# Altium schematic sheet 5_Motor_Controller.SchDoc
size A
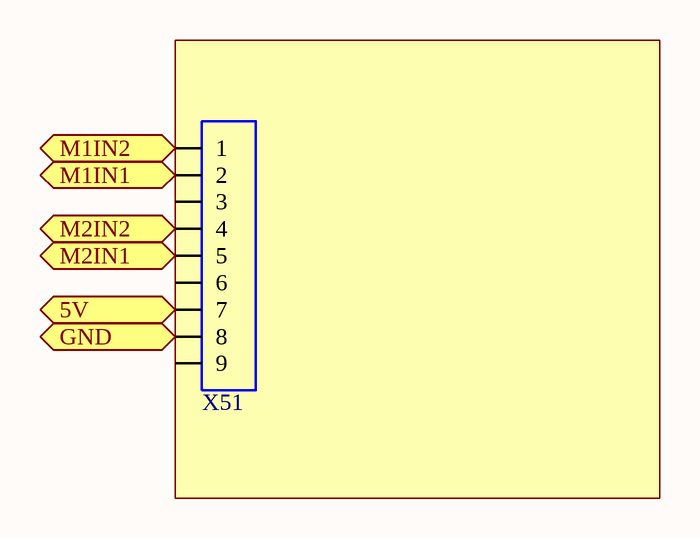
[diagram p0: 5_Motor_Controller.SchDoc]

## Parts
X51  TE 87220-9  [HDR-0.1-9]  (value not drawn)

## Ports
5V, GND, M1IN1, M1IN2, M2IN1, M2IN2

## Nets
5V: X51.7 ; port 5V
GND: X51.8 ; port GND
M1IN1: X51.2 ; port M1IN1
M1IN2: X51.1 ; port M1IN2
M2IN1: X51.5 ; port M2IN1
M2IN2: X51.4 ; port M2IN2

Not connected (* = marked no-connect by the designer): X51 3 6 9

## Library data of the parts
X51 = 7236: Connector 9 pin general; Part Field 1: CONN9 9X1 2.54mm VERT PIN HEADER; Manufacturer: TE Connectivity; IPN: 7236; EndOfLife: Active EOL:Jul 2022; Characteristics: 0.78um GOLD; Lead_Process_Compatible: Yes; SubmittedBy: ZAD; DeviceRank: 2; Part Field 2: TE Connectivity 87220-9; ComponentLink1Description: TE_87220_Series_DS.pdf; ComponentLink2Description: TE_87220-9_RoHS.pdf; ComponentLink1URL: \\michelangelo\erg shared folder\ECAD\elecCAD\apps\BomGen\Data\rel\datasheets\new_parts\TE_87220_Series_DS.pdf; ComponentLink2URL: \\michelangelo\erg shared folder\ECAD\elecCAD\apps\BomGen\Data\rel\rohs_compliance\new_certificates\TE_87220-9_RoHS.pdf; Altium_Comment_Old: CONN9 9X1 2.54mm VERT PIN HEADER; Altium_Comment: TE 87220-9; Symbol: CONN9; PartNumber: 87220-9; LastChanged: 11/12/13 08:07:33; Supplier1: Mouser; Supplier1_PartNumber: 571-87220-9; IPN_Search: 7236; PartType: PCB; Price: 3.60 USD; CheckedBy: PFU; Price_100: M$2.970; Price_1000: M$2.700; Price_5000: M$2.700